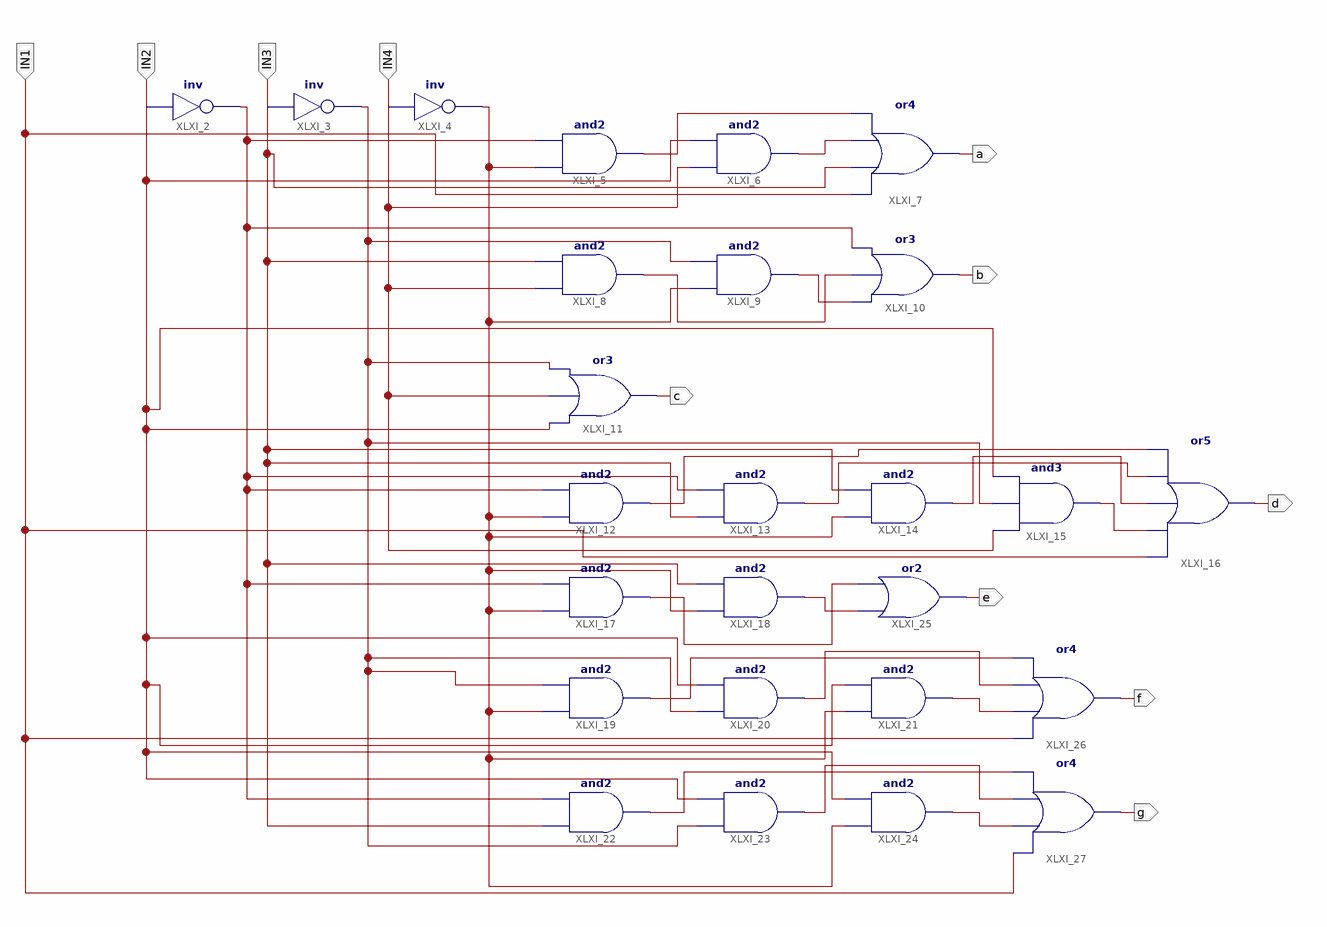
[diagram p0: schematic sheet 1]
// Xilinx ISE schematic BCD_EAKLAEW.sch (spartan6) as structural Verilog: 26 symbols, 11 ports
module BCD_EAKLAEW (
  input  IN1,
  input  IN2,
  input  IN3,
  input  IN4,
  output a,
  output b,
  output c,
  output d,
  output e,
  output f,
  output g
);

  wire XLXN_8, XLXN_9, XLXN_10, XLXN_12, XLXN_13, XLXN_14, XLXN_16, XLXN_20, XLXN_21, XLXN_22, XLXN_24,
       XLXN_26, XLXN_27, XLXN_29, XLXN_30, XLXN_32, XLXN_34, XLXN_35, XLXN_36;

  not XLXI_2 (XLXN_14, IN2);
  not XLXI_3 (XLXN_16, IN3);
  not XLXI_4 (XLXN_8, IN4);
  and XLXI_5 (XLXN_9, XLXN_8, XLXN_14);
  and XLXI_6 (XLXN_10, IN4, IN2);
  or XLXI_7 (a, IN1, IN3, XLXN_10, XLXN_9);
  and XLXI_8 (XLXN_12, IN4, IN3);
  and XLXI_9 (XLXN_13, XLXN_8, XLXN_16);
  or XLXI_10 (b, XLXN_13, XLXN_12, XLXN_14);
  or XLXI_11 (c, IN2, IN4, XLXN_16);
  and XLXI_12 (XLXN_20, XLXN_8, XLXN_14);
  and XLXI_13 (XLXN_21, IN3, XLXN_14);
  and XLXI_14 (XLXN_22, XLXN_8, IN3);
  and XLXI_15 (XLXN_24, IN4, XLXN_16, IN2);
  or XLXI_16 (d, IN1, XLXN_24, XLXN_22, XLXN_21, XLXN_20);
  and XLXI_17 (XLXN_26, XLXN_8, XLXN_14);
  and XLXI_18 (XLXN_27, XLXN_8, IN3);
  and XLXI_19 (XLXN_29, XLXN_8, XLXN_16);
  and XLXI_20 (XLXN_30, XLXN_16, IN2);
  and XLXI_21 (XLXN_32, XLXN_8, IN2);
  and XLXI_22 (XLXN_34, IN3, XLXN_14);
  and XLXI_23 (XLXN_35, XLXN_16, IN2);
  and XLXI_24 (XLXN_36, XLXN_8, IN2);
  or XLXI_25 (e, XLXN_27, XLXN_26);
  or XLXI_26 (f, IN1, XLXN_32, XLXN_30, XLXN_29);
  or XLXI_27 (g, IN1, XLXN_36, XLXN_35, XLXN_34);
endmodule
